# EAGLE design CoolderPSU (EAGLE 8.5.0)
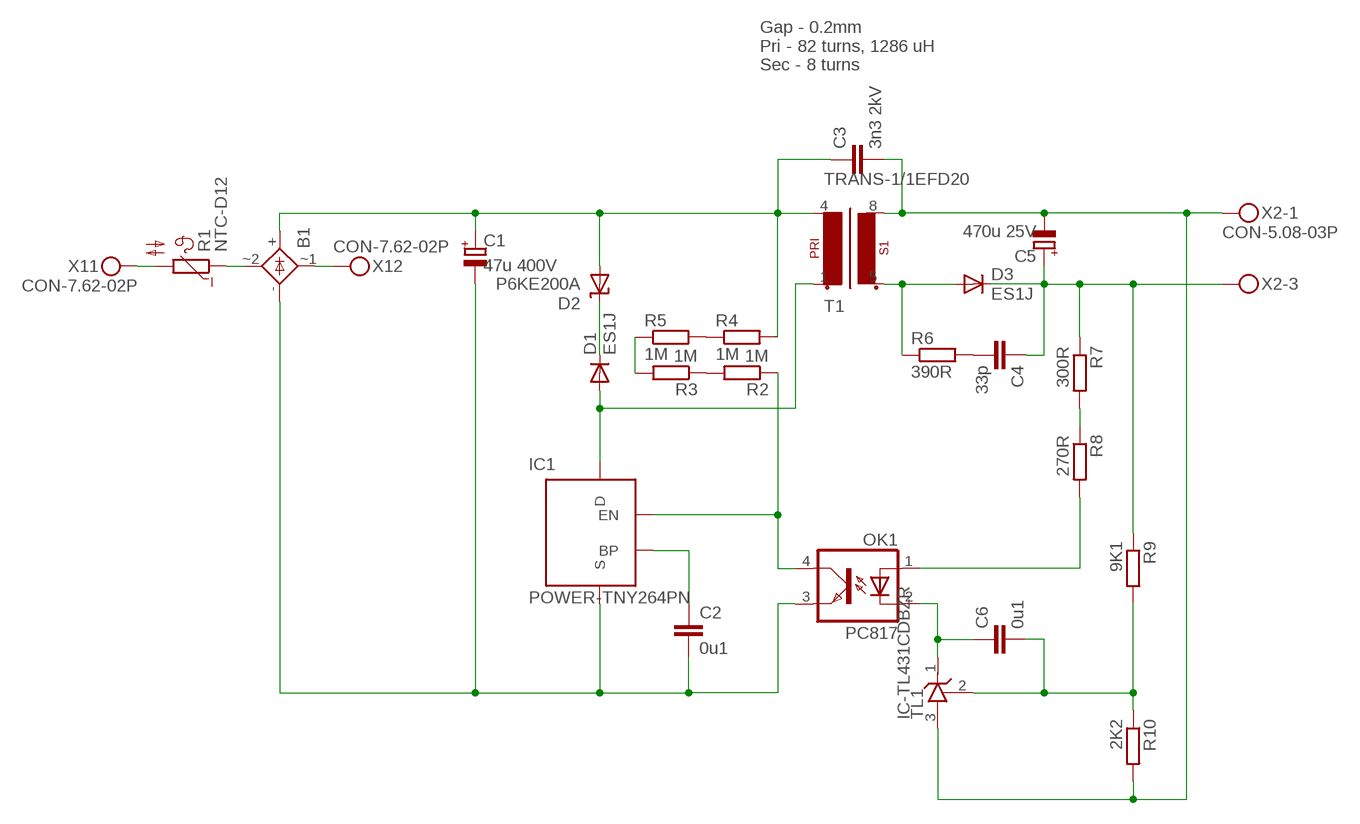
[diagram p0: schematic, sheet 1]

## Parts
B1  RECTIFIERSOIC-8  [SOIC-4]
C1  47u 400V  CAP-POL_E7,5-16  [E7,5-16-32-HORIZ]
C2  0u1  CAP_0805  [C0805]
C3  3n3 2kV  CAP_C50-024X044  [C050-024X044]
C4  33p  CAP_0805  [C0805]
C5  470u 25V  CAP-POL_E2.5-7  [E2,5-7]
C6  0u1  CAP_0805  [C0805]
D1  ES1J  DIODE_ES1J  [DO214AC]
D2  P6KE200A  SUPRESSORDO-204AC  [DO15-12]
D3  ES1J  DIODE_ES1J  [DO214AC]
IC1  POWER-TNY264PN  [DIP-8B]
OK1  PC817  OPTOTRANSPC817  [DIL04]
R1  NTC-D12  [NTC-D12]
R2  1M  R_1206  [R1206]
R3  1M  R_1206  [R1206]
R4  1M  R_1206  [R1206]
R5  1M  R_1206  [R1206]
R6  390R  R_1206  [R1206]
R7  300R  R_1206  [R1206]
R8  270R  R_1206  [R1206]
R9  9K1  R_1206  [R1206]
R10  2K2  R_1206  [R1206]
T1  TRANS-1/1EFD20  [EFD20_8PIN]
TL1  IC-TL431CDBZR  [SOT23]
X1  CON-7.62-02P  [KF25C-7.62-02P-13]
X2  CON-5.08-03P  [MKDSN1,5/3-5,08]

## Nets
N$1: R1.2 X1.P$1
N$2: B1.~2(AC2) R1.1
N$3: B1.~1(AC1) X1.P$2
N$4: B1.+ C1.+ C3.1 D2.A R4.2 T1.4(P1-2)
N$5: B1.- C1.- C2.2 IC1.2(S) IC1.3(S) IC1.7(S) IC1.8(S) OK1.3(EMIT)
N$6: D1.A IC1.5(D) T1.1(P1-1)
N$7: D1.C D2.C
N$8: R2.2 R3.1
N$9: R4.1 R5.2
N$10: IC1.4(EN) OK1.4(COL) R2.1
N$11: R3.2 R5.1
N$12: C2.1 IC1.1(BP)
N$13: C3.2 C5.- R10.2 T1.8(S1-2) TL1.3(A) X2.1
N$14: D3.A R6.1 T1.5(S1-1)
N$15: C4.2 R6.2
N$16: C4.1 C5.+ D3.C R7.1 R9.1 X2.3
N$17: C6.1 OK1.2(C) TL1.1(C)
N$18: R7.2 R8.1
N$19: OK1.1(A) R8.2
N$21: C6.2 R9.2 R10.1 TL1.2(R)
Unconnected: X2.2

## Notes on the sheet
- Gap - 0.2mm
  Pri - 82 turns, 1286 uH
  Sec - 8 turns

## Library data of the parts
B1 = Namenlos:RECTIFIER: DIOTEC RECTIFIER
C1 C5 = Namenlos:CAP-POL_
C2-C4 C6 = Namenlos:CAP_
D1 D3 = Namenlos:DIODE_
D2 = Namenlos:SUPRESSOR
IC1 = Namenlos:POWER-TNY264PN
OK1 = Namenlos:OPTOTRANS: SHARP OPTO COUPLER; MPN: PC817X4J000F; OC_FARNELL: 9707727; OC_NEWARK: 97K7059
R1 = Namenlos:NTC-D12
R2-R10 = Namenlos:R_
T1 = Namenlos:TRANS-1/1
TL1 = Namenlos:IC-TL431
X1 = Namenlos:CON-7.62-02P
X2 = Namenlos:CON-5.08-03P: MKDSN 1,5/ 3-5,08 Printklemme Nennstrom: 13,5 A Nennspannung: 250 V Rastermaß: 5,08 mm Polzahl: 3 Anschlussart: Schraubanschluss Montage: Löten Anschlussrichtung Leiter/Platine: 0 ° Artikelnummer: 1729131 Source: http://eshop.phoenixcontact.com .. 1729131.pdf

## Board
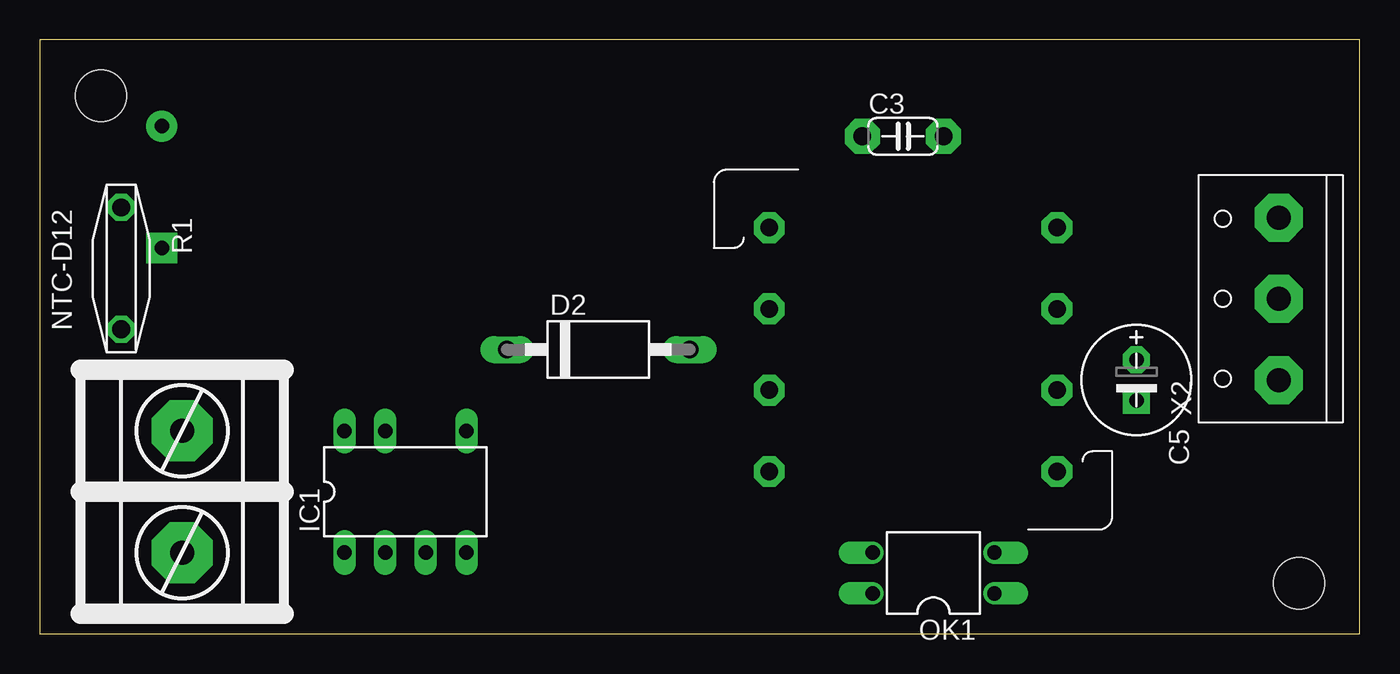
[diagram p1: board, top side]
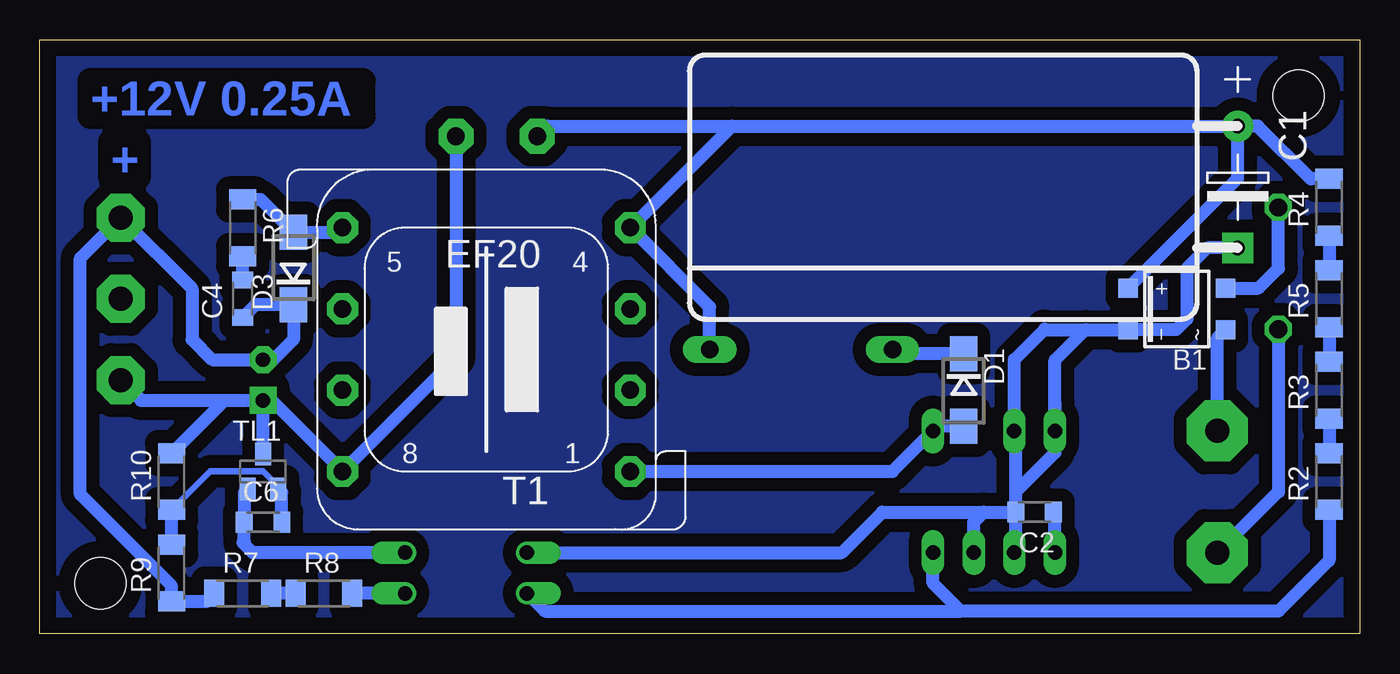
[diagram p2: board, bottom side, seen from below]

Size 82.53 x 37.13 mm. Coordinates in mm from the lower left corner, seen from the top.
Outline: 0,0 82.53,0 82.53,37.13 0,37.13 0,0
Copper layers (1*16): Top 0.035mm / dielectric 1.5mm / Bottom 0.035mm
Design rules "default": minimum track width 6mil, minimum drill 0.35mm, track to track 6mil, track to pad 6mil, pad to pad 6mil, via to via 6mil, smd to smd 6mil, copper to edge 40mil, drill to drill 6mil, minimum pad ring 10mil, minimum via ring 8mil, stop-mask expansion 4mil, vias tented up to drill 0mil, thermal gap 10mil
Holes 3.2 mm at 78.74,3.17 3.81,33.66

### Footprints (pad centres in the part's own frame; a part is rotated, then mirrored left to right if it is on the bottom)
SOIC-4 = smd 1.2 x 1.2: + 1.3,3.05; - -1.3,3.05; ~1 -1.3,-3.05; ~2 1.3,-3.05
E7,5-16-32-HORIZ = drill 0.9 pad 1.93: + -3.81,0 | drill 0.9 pad 1.93 square: - 3.81,0
C0805 = smd 1.05 x 1.3: 1 -1.175,0; 2 1.175,0
C050-024X044 = drill 1.1 pad 2.184 octagon: 1 -2.54,0; 2 2.54,0
E2,5-7 = drill 0.9 pad 1.676 octagon: + -1.27,0 | drill 0.9 pad 1.676 square: - 1.27,0
DO214AC = smd 2.2 x 1.7: A 2.25,0; C -2.285,0
DO15-12 = drill 1.1 pad 1.676 long: A 5.08,0; C -6.35,0
DIP-8B = drill 0.9 long: 1 -3.81,-3.81; 2 -1.27,-3.81; 3 1.27,-3.81; 4 3.81,-3.81; 5 3.81,3.81; 7 -1.27,3.81; 8 -3.81,3.81
DIL04 = drill 0.9 pad 1.27 offset: 1 -1.27,-3.81; 2 1.27,-3.81; 3 1.27,3.81; 4 -1.27,3.81
NTC-D12 = drill 1.1 pad 1.676 octagon: 1 -3.81,0; 2 3.81,0
R1206 = smd 1.25 x 1.7: 1 -1.775,0; 2 1.775,0
EFD20_8PIN = drill 1.1 pad 1.93 octagon: 1 -9,7.62; 2 -9,2.54; 3 -9,-2.54; 4 -9,-7.62; 5 9,-7.62; 6 9,-2.54; 7 9,2.54; 8 9,7.62
SOT23 = smd 1 x 1.4: 1 -0.95,-1.1; 2 0.95,-1.1; 3 0,1.1
KF25C-7.62-02P-13 = drill 1.5 pad 3.81 octagon: P$1 -3.81,0; P$2 3.81,0
MKDSN1,5/3-5,08 = drill 1.5 pad 3 octagon: 1 -5.08,0; 2 0,0; 3 5.08,0

### Placement (x,y rotation side)
B1  11.43,20.32 90 bottom
C1  7.62,27.94 270 bottom
C2  20.32,7.62 180 bottom
C3  53.98,31.11 0 top
C4  69.85,20.95 90 bottom
C5  68.58,15.88 270 top
C6  68.58,6.99 0 bottom
D1  24.77,15.24 270 bottom
D2  35.56,17.78 0 top
D3  66.67,22.86 90 bottom
IC1  22.86,8.89 0 top
OK1  55.88,3.81 90 top
R1  5.08,22.86 270 top
R2  1.91,9.53 90 bottom
R3  1.91,15.24 90 bottom
R4  1.91,26.67 90 bottom
R5  1.91,20.95 90 bottom
R6  69.85,25.4 270 bottom
R7  69.85,2.54 0 bottom
R8  64.77,2.54 0 bottom
R9  74.3,3.81 90 bottom
R10  74.3,9.53 90 bottom
T1  54.61,17.78 180 bottom
TL1  68.58,10.16 0 bottom
X1  8.89,8.89 90 top
X2  77.47,20.95 90 top

### Tracks (layer width: path | path; a pad name or v marks a point on that pad's centre or on a via)
N$1
  Bottom 0.813: R1.2 5.08,8.89 X1.P$1
N$2
  Bottom 0.813: B1.~2 6.32,21.62 5.08,22.86 R1.1
N$3
  Bottom 0.813: X1.P$2 8.89,18.51 B1.~1
N$4
  Bottom 0.813: B1.+ 7.62,28.48 C1.+ | 39.26,31.75 T1.4 40.64,20.43 D2.A | 39.26,31.75 C1.+ | C3.1 50.8,31.75 39.26,31.75 | R4.2 3.04,28.45 6.35,31.75 C1.+
N$5
  Bottom 0.813: C1.- 9.53,24.13 10.79,22.86 10.79,19.68 11.46,19.02 B1.- 17.14,19.02 | OK1.3 32.38,5.08 29.84,7.62 23.5,7.62 | 23.5,7.62 C2.2 | IC1.2 21.5,5.17 C2.2 | IC1.3 24.13,6.99 23.5,7.62 | C2.2 21.5,8.89 | 21.5,8.89 21.5,12.61 IC1.7 21.59,17.14 19.68,19.05 19.66,19.02 17.14,19.02 | 19.05,14.45 IC1.8 | IC1.8 19.05,17.11 17.14,19.02 | IC1.8 19.05,11.34 21.5,8.89
N$6
  Bottom 0.813: D1.A 26.96,12.99 IC1.5 29.21,10.16 T1.1
N$7
  Bottom 0.813: D1.C 28.95,17.52 D2.C
N$8
  Bottom 0.813: R3.1 R2.2
N$9
  Bottom 0.813: R4.1 R5.2
N$10
  Bottom 0.813: R2.1 1.91,4.6 5.08,1.42 24.92,1.42 | 24.92,1.42 26.67,3.17 IC1.4 | OK1.4 50.95,1.42 24.92,1.42
N$11
  Bottom 0.813: R5.1 R3.2
N$12
  Bottom 0.813: IC1.1 19.05,7.53 C2.1
N$13
  Bottom 0.813: C3.2 56.52,17.25 T1.8 68.06,14.61 C5.- | TL1.3 C5.- | R10.2 70.99,14.61 C5.- | X2.1 76.2,14.61 C5.-
N$14
  Bottom 0.813: R6.1 68.74,27.18 D3.A 63.9,25.11 T1.5
N$15
  Bottom 0.813: C4.2 R6.2
N$16
  Bottom 0.813: C4.1 69.06,20.57 D3.C 66.67,18.41 67.94,17.14 C5.+ 71.75,17.14 73.03,18.41 73.03,21.59 X2.3 80.01,23.5 80.01,8.72 74.3,3 R9.1 72.13,2.04 R7.1
N$17
  Bottom 0.813: OK1.2 69.22,5.08 69.85,5.71 69.75,5.81 C6.1 69.75,8.84 TL1.1
N$18
  Bottom 0.813: R8.1 R7.2
N$19
  Bottom 0.813: OK1.1 R8.2
N$20
  pour Bottom (isolate 0.813): 0,37.47 82.55,37.47 82.55,0 0,0
N$21
  Bottom 0.406: TL1.2 67.63,9.21 68.58,10.16 71.89,10.16 R10.1
  Bottom 0.813: R9.2 R10.1 | C6.2 67.41,8.84 TL1.2

### Text on the board
Bottom: +12V 0.25A | +